# Altium project VM52T2.PrjPcb
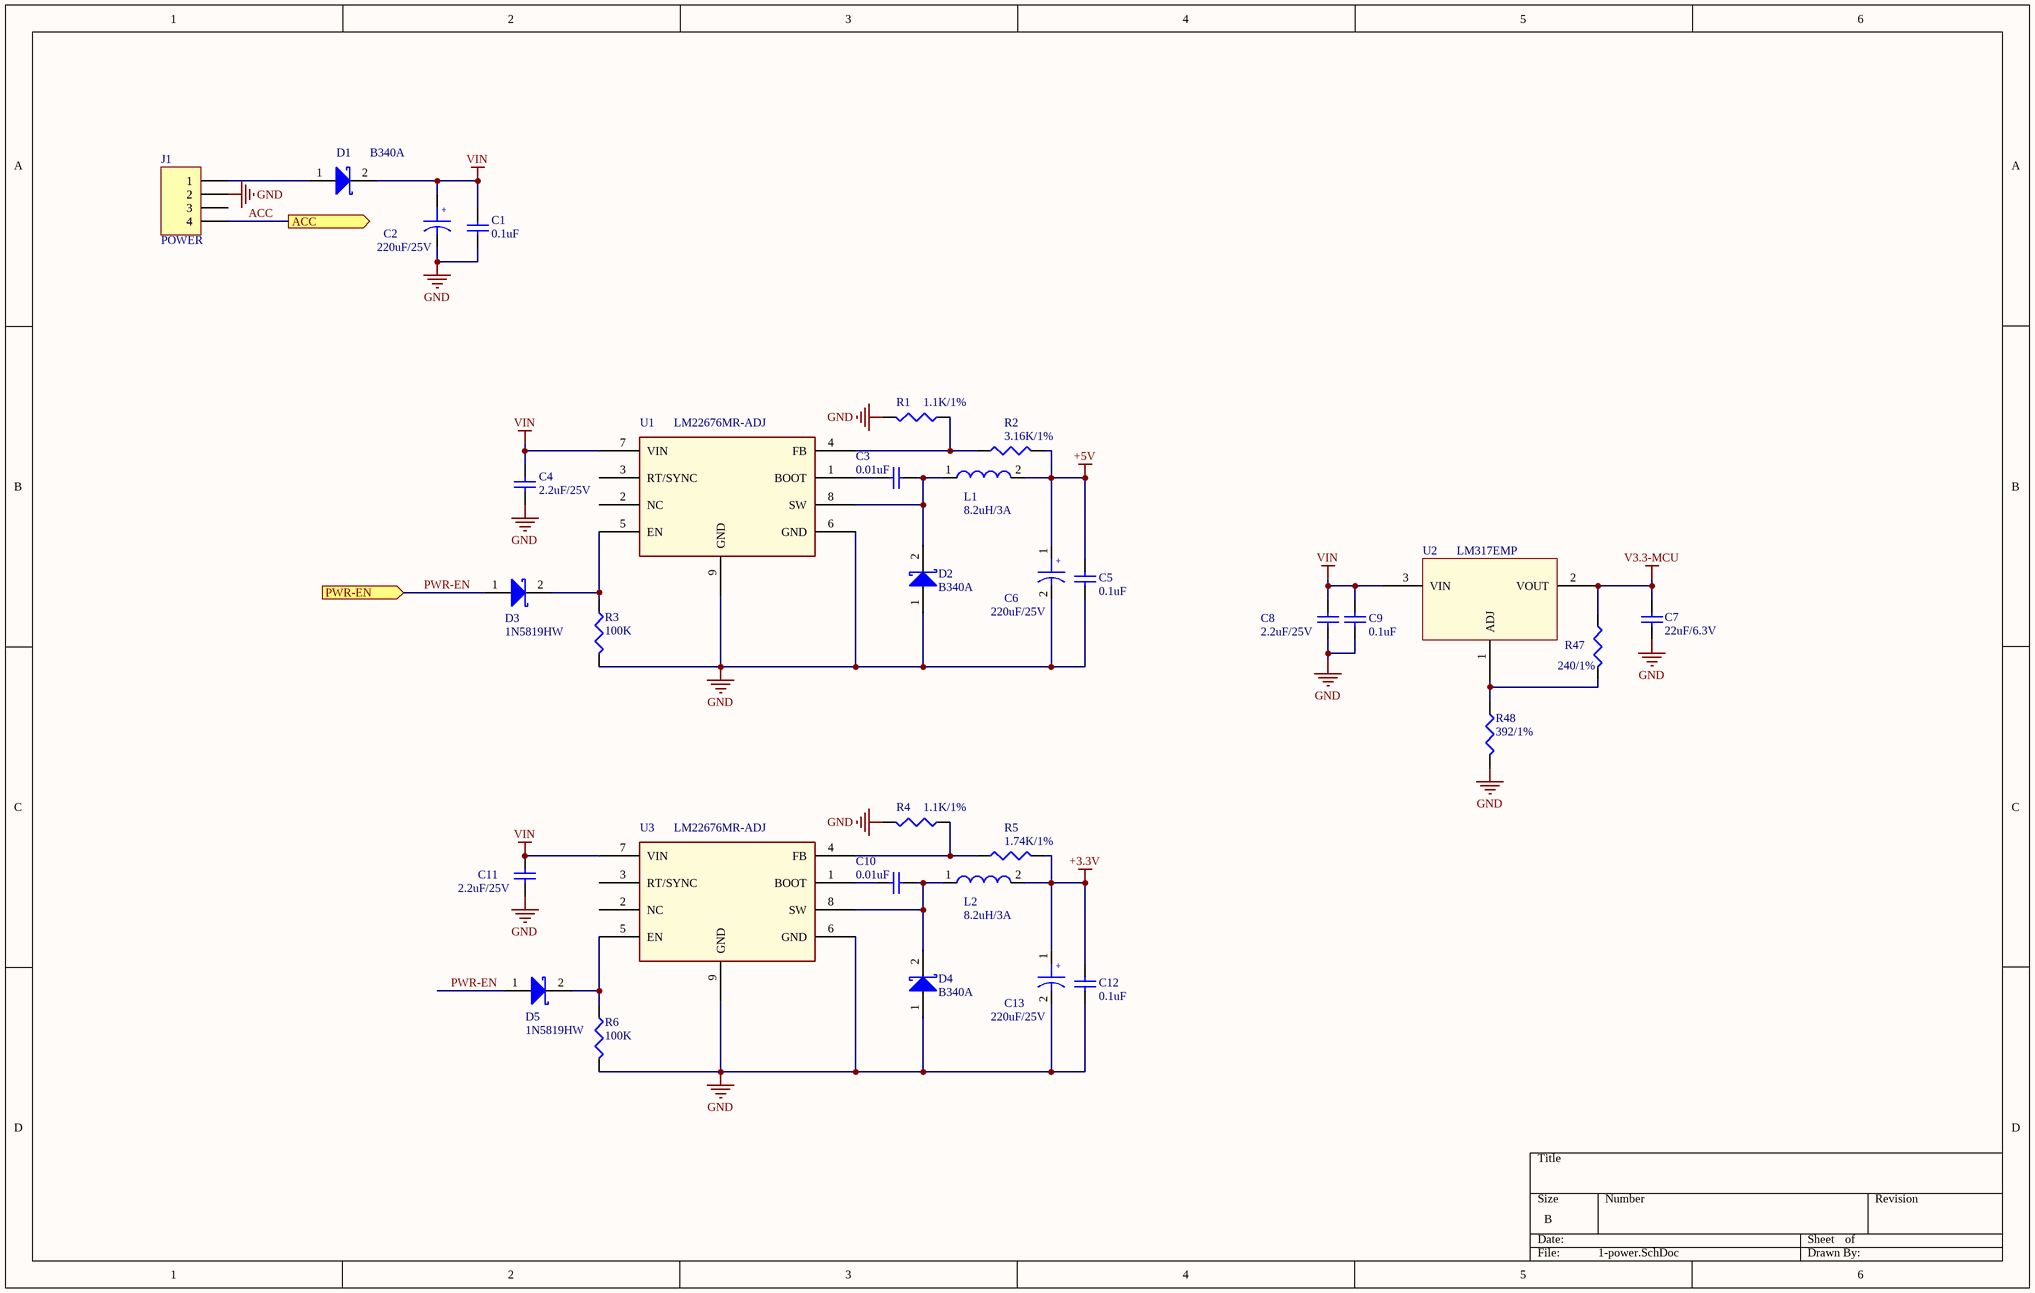
[diagram p0: 1-power.SchDoc]
8 sheets, 188 parts. Net scope: flat (ports and power ports of the same name join across sheets).
Board file: VM52-T2.PcbDoc
Sheets:
  1-power.SchDoc
  2-mcu.SchDoc
  3-core_board.SchDoc
  4-storage.SchDoc
  5-gsm.SchDoc
  6-gsm_ctrl.SchDoc
  7-serial-interfaces.SchDoc
  8-connector.SchDoc

## Sheet 1-power.SchDoc
size B

### Parts
C1  0.1uF  [0603]
C2  220uF/25V  [DL-8*10.5]
C3  0.01uF  [0603]
C4  2.2uF/25V  [1210]
C5  0.1uF  [0603]
C6  220uF/25V  [DL-8*10.5]
C7  22uF/6.3V  [1206]
C8  2.2uF/25V  [1210]
C9  0.1uF  [0603]
C10  0.01uF  [0603]
C11  2.2uF/25V  [1210]
C12  0.1uF  [0603]
C13  220uF/25V  [DL-8*10.5]
D1  B340A  [B320A]
D2  B340A  [B320A]
D3  1N5819HW  [1N5819]
D4  B340A  [B320A]
D5  1N5819HW  [1N5819]
J1  POWER  [3030WV-F-2*2P]
L1  8.2uH/3A  [IND_8.2UH_3A]
L2  8.2uH/3A  [IND_8.2UH_3A]
R1  1.1K/1%  [0603]
R2  3.16K/1%  [0603]
R3  100K  [0603]
R4  1.1K/1%  [0603]
R5  1.74K/1%  [0603]
R6  100K  [0603]
R47  240/1%  [0603]
R48  392/1%  [0603]
U1  LM22676MR-ADJ  [PSO8]
U2  LM317EMP  [SOT-223]
U3  LM22676MR-ADJ  [PSO8]

### Ports
ACC (out), PWR-EN (in)

### Nets
+3.3V: C12.2 C13.1 L2.2 R5.2
+5V: C5.2 C6.1 L1.2 R2.2
GND: C1.1 C2.2 C4.1 C5.1 C6.2 C7.1 C8.1 C9.2 C11.1 C12.1 C13.2 D2.1(A) D4.1(A) J1.2 R1.2 R3.2 R4.2 R6.2 R48.2 U1.6(GND) U1.9(GND) U3.6(GND) U3.9(GND)
V3.3-MCU: C7.2 R47.1 U2.2(VOUT)
VIN: C1.2 C2.1 C4.2 C8.2 C9.1 C11.2 D1.2(K) U1.7(VIN) U2.3(VIN) U3.7(VIN)
ACC: J1.4 ; port ACC
PWR-EN: D3.1(A) D5.1(A) ; port PWR-EN
NetC3_1: C3.1 D2.2(K) L1.1 U1.8(SW)
NetC3_2: C3.2 U1.1(BOOT)
NetC10_1: C10.1 D4.2(K) L2.1 U3.8(SW)
NetC10_2: C10.2 U3.1(BOOT)
NetD1_1: D1.1(A) J1.1
NetD3_2: D3.2(K) R3.1 U1.5(EN)
NetD5_2: D5.2(K) R6.1 U3.5(EN)
NetR1_1: R1.1 R2.1 U1.4(FB)
NetR4_1: R4.1 R5.1 U3.4(FB)
NetR47_2: R47.2 R48.1 U2.1(ADJ)

Not connected (* = marked no-connect by the designer): J1 3; U1 2(NC) 3(RT/SYNC); U3 2(NC) 3(RT/SYNC)

### Notes on the sheet
- (in symbol CAP WP) +

### Library data of the parts
C1 C5 C9 C12 = Cap: Capacitor; Published: 8-Jun-2000; LatestRevisionDate: 17-Jul-2002; LatestRevisionNote: Re-released for DXP Platform.; PackageReference: RAD-0.3; Publisher: Altium Limited; PackageDescription: Radial Cap, Thru-Hole; 2 Leads; 0.3 in Pin Spacing; Value: 0.1uF
C2 C6 C13 = CAP WP
C3 C4 C7 C8 C10 C11 = Cap: Capacitor; Value: 0.1uF; Published: 8-Jun-2000; LatestRevisionDate: 17-Jul-2002; LatestRevisionNote: Re-released for DXP Platform.; PackageReference: RAD-0.3; Publisher: Altium Limited; PackageDescription: Radial Cap, Thru-Hole; 2 Leads; 0.3 in Pin Spacing
D1-D5 = Diode 11DQ03: Schottky Rectifier
J1 = Header 4: Header, 4-Pin; LatestRevisionDate: 17-Jul-2002; LatestRevisionNote: Re-released for DXP Platform.; Publisher: Altium Limited
L1 L2 = 4.7UH_CDH2D09BNP-4R7MC_0.7A_20%: Part Number: SH00000AJ00; ROOM: +1.3V_CORE
R1-R6 R47 R48 = Res3: Resistor; Value: 1K; Published: 8-Jun-2000; LatestRevisionDate: 29-May-2009; LatestRevisionNote: IPC-7351 Footprint Added.; PackageReference: J1-0603; Publisher: Altium Limited; PackageDescription: Chip Resistor
U1 U3 = LM22670_0

## Sheet 2-mcu.SchDoc
size B
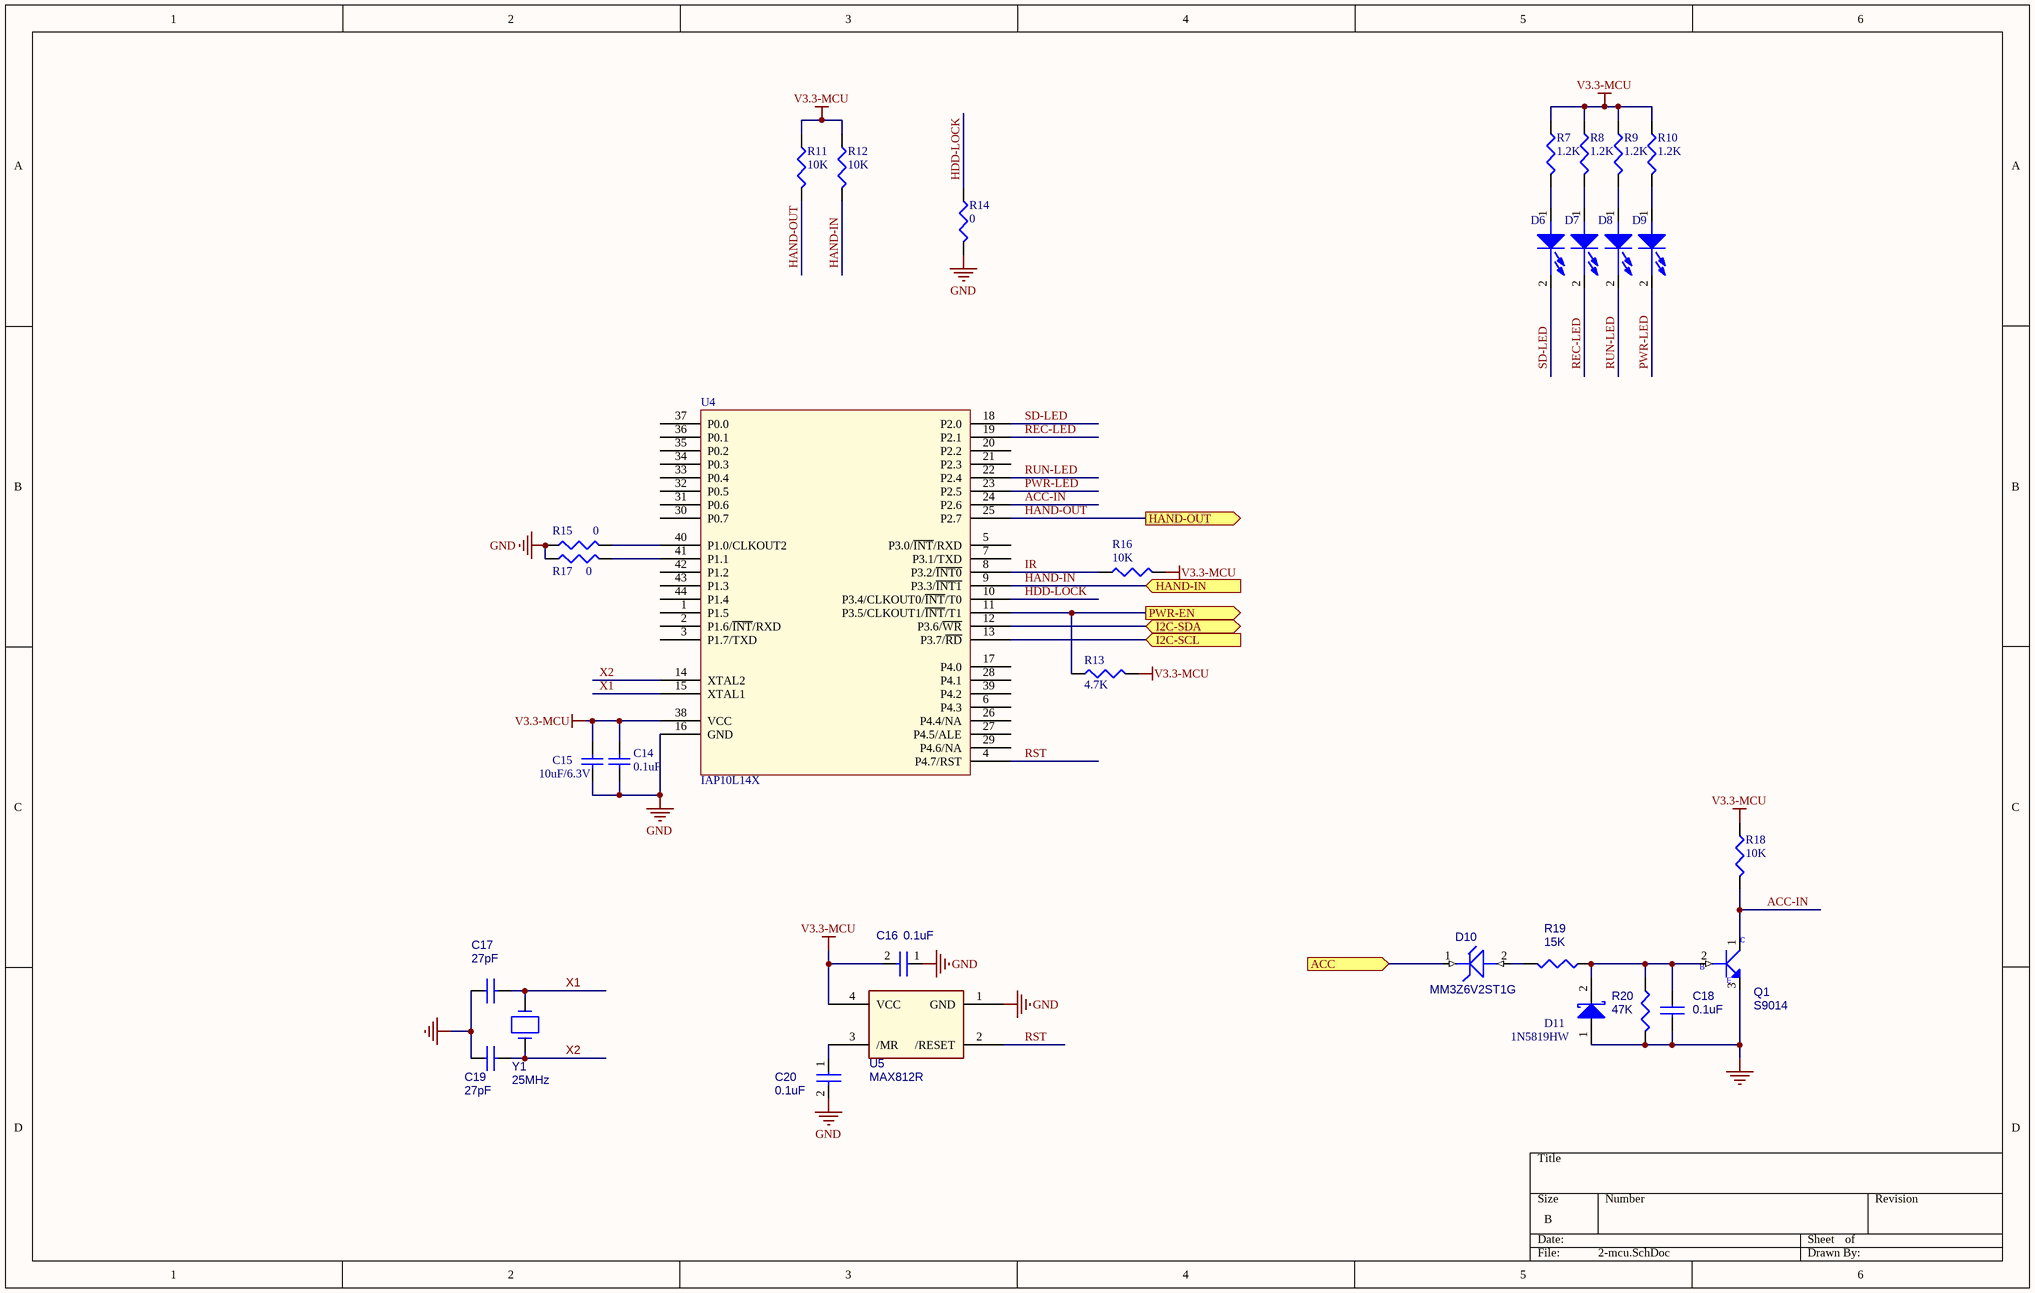
[diagram p1: 2-mcu.SchDoc]

### Parts
C14  0.1uF  [0603]
C15  10uF/6.3V  [0805]
C16  0.1uF  [0603]
C17  27pF  [0603]
C18  0.1uF  [0603]
C19  27pF  [0603]
C20  0.1uF  [0603]
D6  LED GREEN  [LED0603]  (value not drawn)
D7  LED GREEN  [LED0603]  (value not drawn)
D8  LED GREEN  [LED0603]  (value not drawn)
D9  LED GREEN  [LED0603]  (value not drawn)
D10  MM3Z6V2ST1G  [MM3Z5V1ST1G]
D11  1N5819HW  [1N5819]
Q1  S9014  [NPN]
R7  1.2K  [0603]
R8  1.2K  [0603]
R9  1.2K  [0603]
R10  1.2K  [0603]
R11  10K  [0603]
R12  10K  [0603]
R13  4.7K  [0603]
R14  0  [0603]
R15  0  [0603]
R16  10K  [0603]
R17  0  [0603]
R18  10K  [0603]
R19  15K  [0603]
R20  47K  [0603]
U4  IAP10L14X  [LQFP44]
U5  MAX812R  [SOT143]
Y1  25MHz  [SMD-XTAL-5032]

### Ports
ACC (in), HAND-IN (in), HAND-OUT (out), I2C-SCL (in), I2C-SDA (bidir), PWR-EN (out)

### Nets
GND: C14.1 C15.1 C16.1 C17.1 C18.2 C19.1 C20.2 D11.1(A) Q1.3(EMITTER) R14.2 R15.1 R17.1 R20.2 U4.16(GND) U5.1(GND)
V3.3-MCU: C14.2 C15.2 C16.2 R7.1 R8.1 R9.1 R10.1 R11.1 R12.1 R13.2 R16.2 R18.1 U4.38(VCC) U5.4(VCC)
ACC: D10.1 ; port ACC
ACC-IN: Q1.1(COLLECTOR) R18.2 U4.24(P2.6)
HAND-IN: R12.2 U4.9(P3.3/~{INT1}) ; port HAND-IN
HAND-OUT: R11.2 U4.25(P2.7) ; port HAND-OUT
HDD-LOCK: R14.1 U4.10(P3.4/CLKOUT0/~{INT}/T0)
I2C-SCL: U4.13(P3.7/~{RD}) ; port I2C-SCL
I2C-SDA: U4.12(P3.6/~{WR}) ; port I2C-SDA
IR: R16.1 U4.8(P3.2/~{INT0})
PWR-EN: R13.1 U4.11(P3.5/CLKOUT1/~{INT}/T1) ; port PWR-EN
PWR-LED: D9.2(CATHODE) U4.23(P2.5)
REC-LED: D7.2(CATHODE) U4.19(P2.1)
RST: U4.4(P4.7/RST) U5.2(/RESET)
RUN-LED: D8.2(CATHODE) U4.22(P2.4)
SD-LED: D6.2(CATHODE) U4.18(P2.0)
X1: C17.2 U4.15(XTAL1) Y1.2
X2: C19.2 U4.14(XTAL2) Y1.1
NetC18_1: C18.1 D11.2(K) Q1.2(BASE) R19.1 R20.1
NetC20_1: C20.1 U5.3(/MR)
NetD6_1: D6.1(ANODE) R7.2
NetD7_1: D7.1(ANODE) R8.2
NetD8_1: D8.1(ANODE) R9.2
NetD9_1: D9.1(ANODE) R10.2
NetD10_2: D10.2 R19.2
NetR15_2: R15.2 U4.40(P1.0/CLKOUT2)
NetR17_2: R17.2 U4.41(P1.1)

Not connected (* = marked no-connect by the designer): U4 1(P1.5) 2(P1.6/~{INT}/RXD) 3(P1.7/TXD) 5(P3.0/~{INT}/RXD) 6(P4.3) 7(P3.1/TXD) 17(P4.0) 20(P2.2) 21(P2.3) 26(P4.4/NA) 27(P4.5/ALE) 28(P4.1) 29(P4.6/NA) 30(P0.7) 31(P0.6) 32(P0.5) 33(P0.4) 34(P0.3) 35(P0.2) 36(P0.1) 37(P0.0) 39(P4.2) 42(P1.2) 43(P1.3) 44(P1.4)

### Notes on the sheet
- (in symbol MMBT3904_NL_SOT23-3) C; B; E

### Library data of the parts
C14 C15 = Cap: Capacitor
C16 C20 = CAP NP_Dup2
C17 C19 = CAP_Dup1
C18 = CAP
D6-D9 = LN01401_1
D10 = MMGZ5231BPTLL34
D11 = Diode 11DQ03: Schottky Rectifier
Q1 = MMBT3904_NL_SOT23-3: Part Description: S TR MMBT3904_NL NPN SOT23; Part Number: SB039040000
R7-R18 = CR16-1003FM
R19 R20 = R
U5 = MAX811
Y1 = CRYSTAL

## Sheet 3-core_board.SchDoc
size B
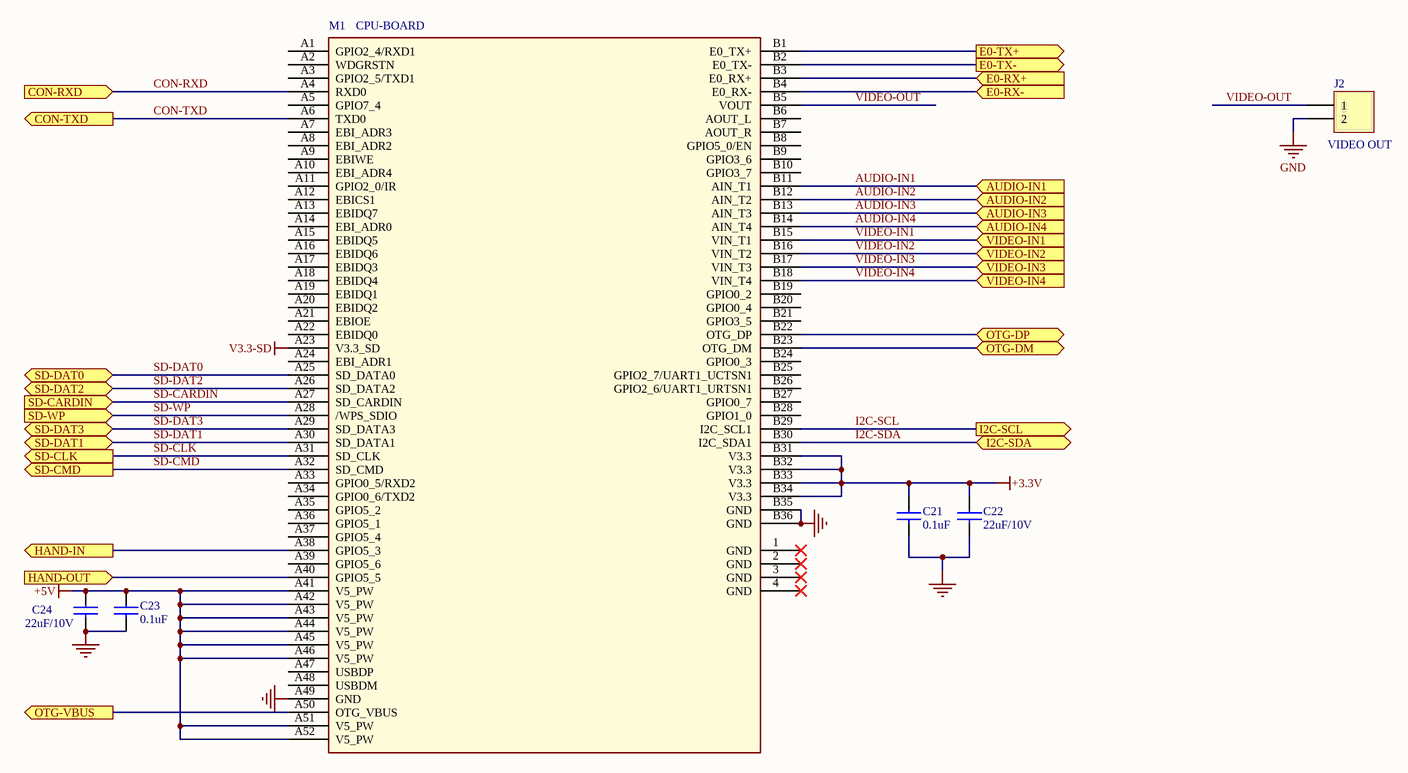
[diagram p2: 3-core_board.SchDoc]

### Parts
C21  0.1uF  [0603]
C22  22uF/10V  [1210]
C23  0.1uF  [0603]
C24  22uF/10V  [1210]
J2  VIDEO OUT  [CON-2PIN]
M1  CPU-BOARD  [cpu-board]

### Ports
AUDIO-IN1 (in), AUDIO-IN2 (in), AUDIO-IN3 (in), AUDIO-IN4 (in), CON-RXD (in), CON-TXD (out), E0-RX+ (in), E0-RX- (in), E0-TX+ (out), E0-TX- (out), HAND-IN (out), HAND-OUT (in), I2C-SCL (out), I2C-SDA (bidir), OTG-DM (bidir), OTG-DP (bidir), OTG-VBUS (out), SD-CARDIN (in), SD-CLK (out), SD-CMD (out), SD-DAT0 (bidir), SD-DAT1 (bidir), SD-DAT2 (bidir), SD-DAT3 (bidir), SD-WP (in), VIDEO-IN1 (in), VIDEO-IN2 (in), VIDEO-IN3 (in), VIDEO-IN4 (in)

### Nets
+3.3V: C21.1 C22.1 M1.B31(V3.3) M1.B32(V3.3) M1.B33(V3.3) M1.B34(V3.3)
+5V: C23.1 C24.1 M1.A41(V5_PW) M1.A42(V5_PW) M1.A43(V5_PW) M1.A44(V5_PW) M1.A45(V5_PW) M1.A46(V5_PW) M1.A51(V5_PW) M1.A52(V5_PW)
GND: C21.2 C22.2 C23.2 C24.2 J2.2 M1.A49(GND) M1.B35(GND) M1.B36(GND)
V3.3-SD: M1.A23(V3.3_SD)
AUDIO-IN1: M1.B11(AIN_T1) ; port AUDIO-IN1
AUDIO-IN2: M1.B12(AIN_T2) ; port AUDIO-IN2
AUDIO-IN3: M1.B13(AIN_T3) ; port AUDIO-IN3
AUDIO-IN4: M1.B14(AIN_T4) ; port AUDIO-IN4
CON-RXD: M1.A4(RXD0) ; port CON-RXD
CON-TXD: M1.A6(TXD0) ; port CON-TXD
ERX_N: M1.B4(E0_RX-) ; port E0-RX-
ERX_P: M1.B3(E0_RX+) ; port E0-RX+
ETX_N: M1.B2(E0_TX-) ; port E0-TX-
ETX_P: M1.B1(E0_TX+) ; port E0-TX+
HAND-IN: M1.A38(GPIO5_3) ; port HAND-IN
HAND-OUT: M1.A40(GPIO5_5) ; port HAND-OUT
I2C-SCL: M1.B29(I2C_SCL1) ; port I2C-SCL
I2C-SDA: M1.B30(I2C_SDA1) ; port I2C-SDA
OTG_N: M1.B23(OTG_DM) ; port OTG-DM
OTG_P: M1.B22(OTG_DP) ; port OTG-DP
SD-CARDIN: M1.A27(SD_CARDIN) ; port SD-CARDIN
SD-CLK: M1.A31(SD_CLK) ; port SD-CLK
SD-CMD: M1.A32(SD_CMD) ; port SD-CMD
SD-DAT0: M1.A25(SD_DATA0) ; port SD-DAT0
SD-DAT1: M1.A30(SD_DATA1) ; port SD-DAT1
SD-DAT2: M1.A26(SD_DATA2) ; port SD-DAT2
SD-DAT3: M1.A29(SD_DATA3) ; port SD-DAT3
SD-WP: M1.A28(/WPS_SDIO) ; port SD-WP
VBUS: M1.A50(OTG_VBUS) ; port OTG-VBUS
VIDEO-IN1: M1.B15(VIN_T1) ; port VIDEO-IN1
VIDEO-IN2: M1.B16(VIN_T2) ; port VIDEO-IN2
VIDEO-IN3: M1.B17(VIN_T3) ; port VIDEO-IN3
VIDEO-IN4: M1.B18(VIN_T4) ; port VIDEO-IN4
VIDEO-OUT: J2.1 M1.B5(VOUT)

Not connected (* = marked no-connect by the designer): M1 1(GND)* 2(GND)* 3(GND)* 4(GND)* A1(GPIO2_4/RXD1) A2(WDGRSTN) A3(GPIO2_5/TXD1) A5(GPIO7_4) A7(EBI_ADR3) A8(EBI_ADR2) A9(EBIWE) A10(EBI_ADR4) A11(GPIO2_0/IR) A12(EBICS1) A13(EBIDQ7) A14(EBI_ADR0) A15(EBIDQ5) A16(EBIDQ6) A17(EBIDQ3) A18(EBIDQ4) A19(EBIDQ1) A20(EBIDQ2) A21(EBIOE) A22(EBIDQ0) A24(EBI_ADR1) A33(GPIO0_5/RXD2) A34(GPIO0_6/TXD2) A35(GPIO5_2) A36(GPIO5_1) A37(GPIO5_4) A39(GPIO5_6) A47(USBDP) A48(USBDM) B6(AOUT_L) B7(AOUT_R) B8(GPIO5_0/EN) B9(GPIO3_6) B10(GPIO3_7) B19(GPIO0_2) B20(GPIO0_4) B21(GPIO3_5) B24(GPIO0_3) B25(GPIO2_7/UART1_UCTSN1) B26(GPIO2_6/UART1_URTSN1) B27(GPIO0_7) B28(GPIO1_0)

### Library data of the parts
C21-C24 = CAP NP_Dup2
J2 = Header 2: Header, 2-Pin; LatestRevisionDate: 17-Jul-2002; LatestRevisionNote: Re-released for DXP Platform.; Publisher: Altium Limited
M1 = CPU-BOARD_4

## Sheet 4-storage.SchDoc
size A4
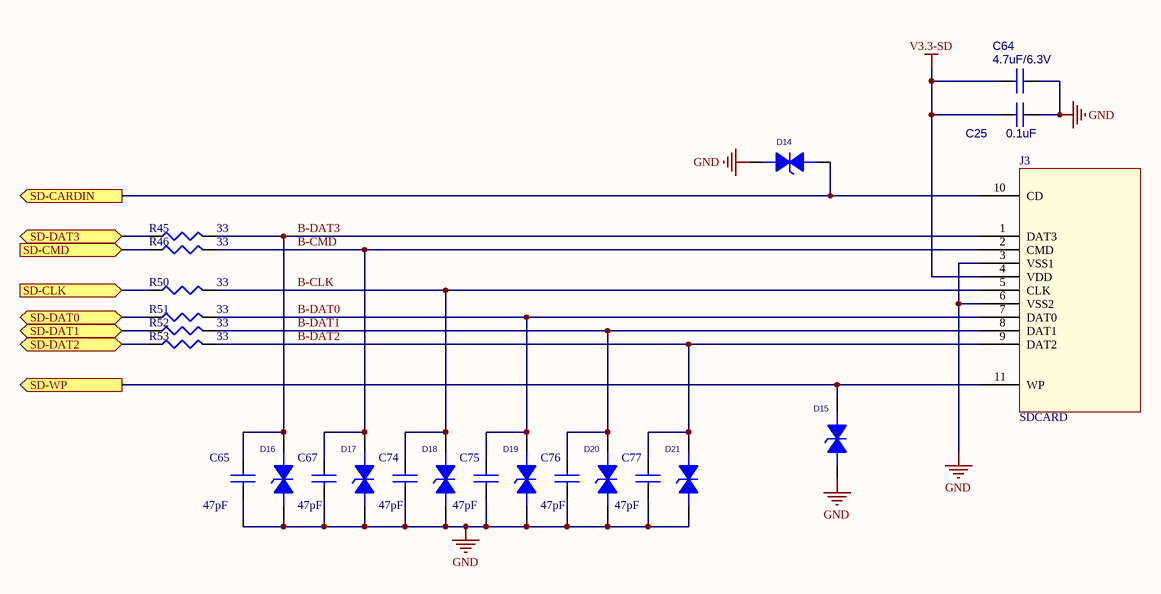
[diagram p3: 4-storage.SchDoc]

### Parts
C25  0.1uF  [0603]
C64  4.7uF/6.3V  [0805]
C65  47pF  [0402]
C67  47pF  [0402]
C74  47pF  [0402]
C75  47pF  [0402]
C76  47pF  [0402]
C77  47pF  [0402]
D14  SMV0402G5R6N121T  [0402]  (value not drawn)
D15  SMV0402G5R6N121T  [0402]  (value not drawn)
D16  SMV0402G5R6N121T  [0402]  (value not drawn)
D17  SMV0402G5R6N121T  [0402]  (value not drawn)
D18  SMV0402G5R6N121T  [0402]  (value not drawn)
D19  SMV0402G5R6N121T  [0402]  (value not drawn)
D20  SMV0402G5R6N121T  [0402]  (value not drawn)
D21  SMV0402G5R6N121T  [0402]  (value not drawn)
J3  SDCARD  [SDCARD]
R45  33  [0603]
R46  33  [0603]
R50  33  [0603]
R51  33  [0603]
R52  33  [0603]
R53  33  [0603]

### Ports
SD-CARDIN (out), SD-CLK (in), SD-CMD (in), SD-DAT0 (bidir), SD-DAT1 (bidir), SD-DAT2 (bidir), SD-DAT3 (bidir), SD-WP (out)

### Nets
GND: C25.1 C64.1 C65.2 C67.2 C74.2 C75.2 C76.2 C77.2 D14.2 D15.1 D16.1 D17.1 D18.1 D19.1 D20.1 D21.1 J3.3(VSS1) J3.6(VSS2)
V3.3-SD: C25.2 C64.2 J3.4(VDD)
B-CLK: C74.1 D18.2 J3.5(CLK) R50.2
B-CMD: C67.1 D17.2 J3.2(CMD) R46.2
B-DAT0: C75.1 D19.2 J3.7(DAT0) R51.2
B-DAT1: C76.1 D20.2 J3.8(DAT1) R52.2
B-DAT2: C77.1 D21.2 J3.9(DAT2) R53.2
B-DAT3: C65.1 D16.2 J3.1(DAT3) R45.2
SD-CARDIN: D14.1 J3.10(CD) ; port SD-CARDIN
SD-CLK: R50.1 ; port SD-CLK
SD-CMD: R46.1 ; port SD-CMD
SD-DAT0: R51.1 ; port SD-DAT0
SD-DAT1: R52.1 ; port SD-DAT1
SD-DAT2: R53.1 ; port SD-DAT2
SD-DAT3: R45.1 ; port SD-DAT3
SD-WP: D15.2 J3.11(WP) ; port SD-WP

### Library data of the parts
C25 C64 C65 C67 C74-C77 = CAP NP_Dup2
D14-D21 = PESD
R45 R46 R50-R53 = CR16-1003FM

## Sheet 5-gsm.SchDoc
size B
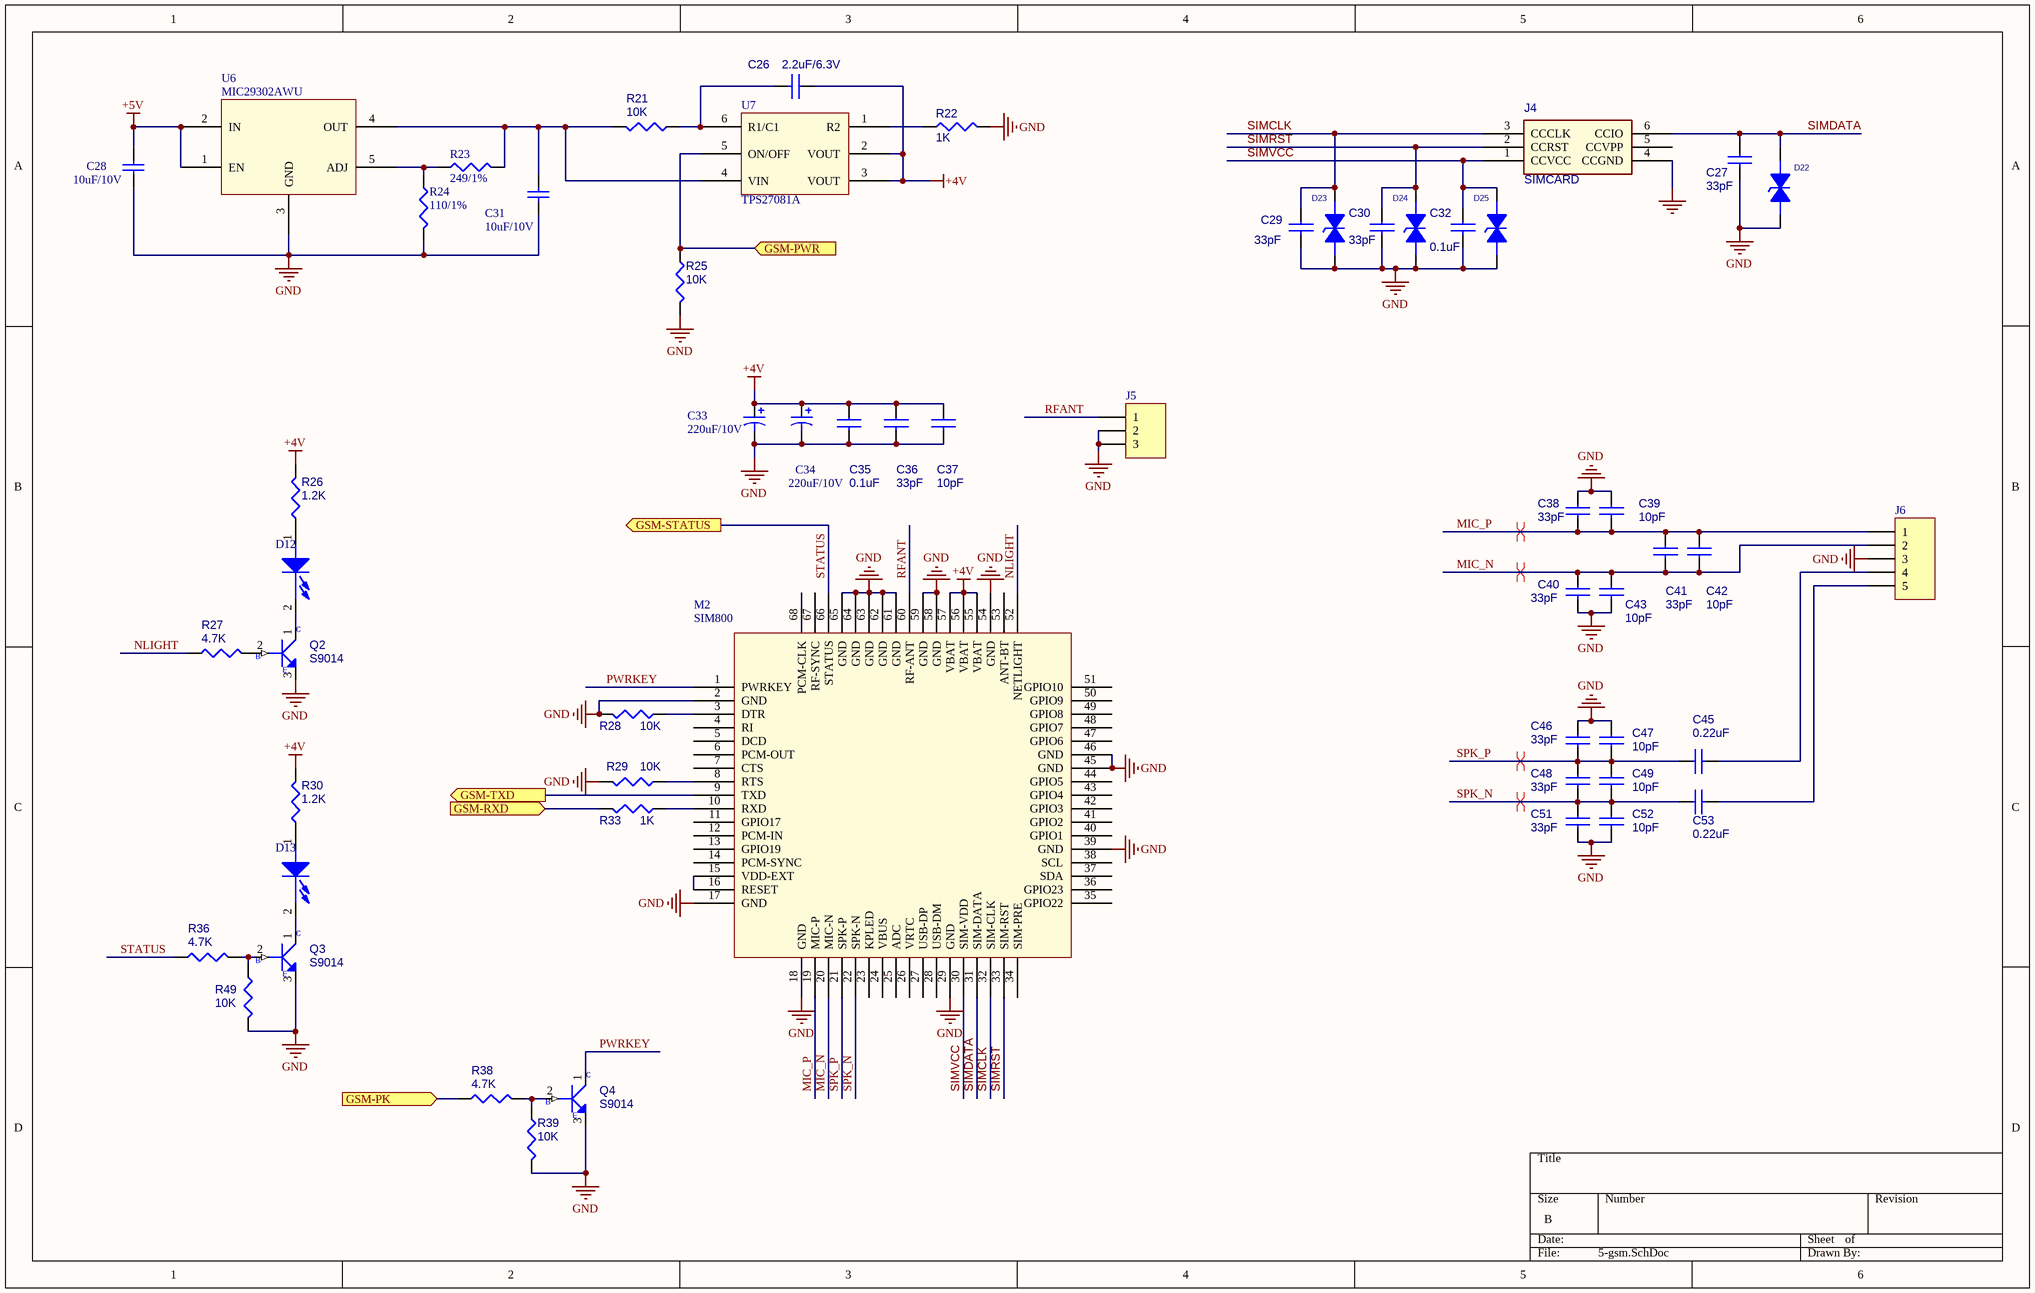
[diagram p4: 5-gsm.SchDoc]

### Parts
C26  2.2uF/6.3V  [0603]
C27  33pF  [0402]
C28  10uF/10V  [1210]
C29  33pF  [0402]
C30  33pF  [0402]
C31  10uF/10V  [1210]
C32  0.1uF  [0402]
C33  220uF/10V  [7343]
C34  220uF/10V  [7343]
C35  0.1uF  [0603]
C36  33pF  [0603]
C37  10pF  [0603]
C38  33pF  [0603]
C39  10pF  [0603]
C40  33pF  [0603]
C41  33pF  [0603]
C42  10pF  [0603]
C43  10pF  [0603]
C45  0.22uF  [0603]
C46  33pF  [0603]
C47  10pF  [0603]
C48  33pF  [0603]
C49  10pF  [0603]
C51  33pF  [0603]
C52  10pF  [0603]
C53  0.22uF  [0603]
D12  LED GREEN  [LED0603]  (value not drawn)
D13  LED GREEN  [LED0603]  (value not drawn)
D22  SMV0402G5R6N121T  [0402]  (value not drawn)
D23  SMV0402G5R6N121T  [0402]  (value not drawn)
D24  SMV0402G5R6N121T  [0402]  (value not drawn)
D25  SMV0402G5R6N121T  [0402]  (value not drawn)
J4  SIMCARD  [SIM_CARD1]
J5  Header 3  [ANT]  (value not drawn)
J6  Header 5  [CON-5PIN]  (value not drawn)
M2  SIM800  [sim800]
Q2  S9014  [NPN]
Q3  S9014  [NPN]
Q4  S9014  [NPN]
R21  10K  [0603]
R22  1K  [0603]
R23  249/1%  [0603]
R24  110/1%  [0603]
R25  10K  [0603]
R26  1.2K  [0603]
R27  4.7K  [0603]
R28  10K  [0603]
R29  10K  [0603]
R30  1.2K  [0603]
R33  1K  [0603]
R36  4.7K  [0603]
R38  4.7K  [0603]
R39  10K  [0603]
R49  10K  [0603]
U6  MIC29302AWU  [TO-263]
U7  TPS27081A  [SOT23-6]

### Ports
GSM-PK (in), GSM-PWR (in), GSM-RXD (in), GSM-STATUS (out), GSM-TXD (out)

### Nets
+4V: C26.1 C33.1 C34.1 C35.1 C36.1 C37.1 M2.55(VBAT) M2.56(VBAT) M2.57(VBAT) R26.1 R30.1 U7.2(VOUT) U7.3(VOUT)
+5V: C28.2 U6.1(EN) U6.2(IN)
GND: C27.2 C28.1 C29.2 C30.2 C31.1 C32.2 C33.2 C34.2 C35.2 C36.2 C37.2 C38.1 C39.1 C40.2 C43.2 C46.1 C47.1 C51.2 C52.2 D22.1 D23.1 D24.1 D25.1 J4.4(CCGND) J5.2 J5.3 J6.3 M2.2(GND) M2.17(GND) M2.18(GND) M2.29(GND) M2.39(GND) M2.45(GND) M2.46(GND) M2.54(GND) M2.58(GND) M2.59(GND) M2.61(GND) M2.62(GND) M2.63(GND) M2.64(GND) M2.65(GND) Q2.3(EMITTER) Q3.3(EMITTER) Q4.3(EMITTER) R22.1 R24.2 R25.1 R28.1 R29.1 R39.1 R49.1 U6.3(GND)
GSM-PK: R38.2 ; port GSM-PK
GSM-PWR: R25.2 U7.5(ON/OFF) ; port GSM-PWR
GSM-RXD: R33.1 ; port GSM-RXD
GSM-TXD: M2.9(TXD) ; port GSM-TXD
MIC_N: C40.1 C41.2 C42.2 C43.1 J6.2 M2.20(MIC-N)
MIC_P: C38.2 C39.2 C41.1 C42.1 J6.1 M2.19(MIC-P)
NLIGHT: M2.52(NETLIGHT) R27.2
PWRKEY: M2.1(PWRKEY) Q4.1(COLLECTOR)
RFANT: J5.1 M2.60(RF-ANT)
SIMCLK: C29.1 D23.2 J4.3(CCCLK) M2.32(SIM-CLK)
SIMDATA: C27.1 D22.2 J4.6(CCIO) M2.31(SIM-DATA)
SIMRST: C30.1 D24.2 J4.2(CCRST) M2.33(SIM-RST)
SIMVCC: C32.1 D25.2 J4.1(CCVCC) M2.30(SIM-VDD)
SPK_N: C48.2 C49.2 C51.1 C52.1 C53.1 M2.22(SPK-N)
SPK_P: C45.1 C46.2 C47.2 C48.1 C49.1 M2.21(SPK-P)
STATUS: M2.66(STATUS) R36.2 ; port GSM-STATUS
NetC26_2: C26.2 R21.2 U7.6(R1/C1)
NetC31_2: C31.2 R21.1 R23.2 U6.4(OUT) U7.4(VIN)
NetC45_2: C45.2 J6.4
NetC53_2: C53.2 J6.5
NetD12_1: D12.1(ANODE) R26.2
NetD12_2: D12.2(CATHODE) Q2.1(COLLECTOR)
NetD13_1: D13.1(ANODE) R30.2
NetD13_2: D13.2(CATHODE) Q3.1(COLLECTOR)
NetM2_3: M2.3(DTR) R28.2
NetM2_8: M2.8(RTS) R29.2
NetM2_10: M2.10(RXD) R33.2
NetM2_15: M2.15(VDD-EXT) M2.16(RESET)
NetQ2_2: Q2.2(BASE) R27.1
NetQ3_2: Q3.2(BASE) R36.1 R49.2
NetQ4_2: Q4.2(BASE) R38.1 R39.2
NetR22_2: R22.2 U7.1(R2)
NetR23_1: R23.1 R24.1 U6.5(ADJ)

Not connected (* = marked no-connect by the designer): J4 5(CCVPP); M2 4(RI) 5(DCD) 6(PCM-OUT) 7(CTS) 11(GPIO17) 12(PCM-IN) 13(GPIO19) 14(PCM-SYNC) 23(KPLED) 24(VBUS) 25(ADC) 26(VRTC) 27(USB-DP) 28(USB-DM) 34(SIM-PRE) 35(GPIO22) 36(GPIO23) 37(SDA) 38(SCL) 40(GPIO1) 41(GPIO2) 42(GPIO3) 43(GPIO4) 44(GPIO5) 47(GPIO6) 48(GPIO7) 49(GPIO8) 50(GPIO9) 51(GPIO10) 53(ANT-BT) 67(RF-SYNC) 68(PCM-CLK)

### Layout directives
differential pair: MIC_N, MIC_P, SPK_N, SPK_P

### Notes on the sheet
- (in symbol MMBT3904_NL_SOT23-3) C; B; E

### Library data of the parts
C26 C27 C29 C30 C32 C35-C43 C45-C49 C51-C53 = P_CAP NP
C28 C31 = Cap: Capacitor; Value: 0.1uF; Published: 8-Jun-2000; LatestRevisionDate: 17-Jul-2002; LatestRevisionNote: Re-released for DXP Platform.; PackageReference: RAD-0.3; Publisher: Altium Limited; PackageDescription: Radial Cap, Thru-Hole; 2 Leads; 0.3 in Pin Spacing
C33 C34 = Cap Pol1: Polarized Capacitor (Radial); Published: 8-Jun-2000; LatestRevisionDate: 17-Jul-2002; LatestRevisionNote: Re-released for DXP Platform.; PackageReference: RB7.6-15; Publisher: Altium Limited; PackageDescription: Polarized Capacitor (Radial); 2 Leads; Value: 220uF/10V
D12 D13 = LN01401_1
D22-D25 = PESD
J5 = Header 3: Header, 3-Pin; LatestRevisionDate: 17-Jul-2002; LatestRevisionNote: Re-released for DXP Platform.; Publisher: Altium Limited
J6 = Header 5: Header, 5-Pin; LatestRevisionDate: 17-Jul-2002; LatestRevisionNote: Re-released for DXP Platform.; Publisher: Altium Limited
Q2-Q4 = MMBT3904_NL_SOT23-3: as Q1 on sheet 2-mcu
R21 R22 R25-R30 R33 R36 R38 R39 R49 = P_R
R23 R24 = Res3: Resistor; Value: 1K; Published: 8-Jun-2000; LatestRevisionDate: 29-May-2009; LatestRevisionNote: IPC-7351 Footprint Added.; PackageReference: J1-0603; Publisher: Altium Limited; PackageDescription: Chip Resistor

## Sheet 6-gsm_ctrl.SchDoc
size B
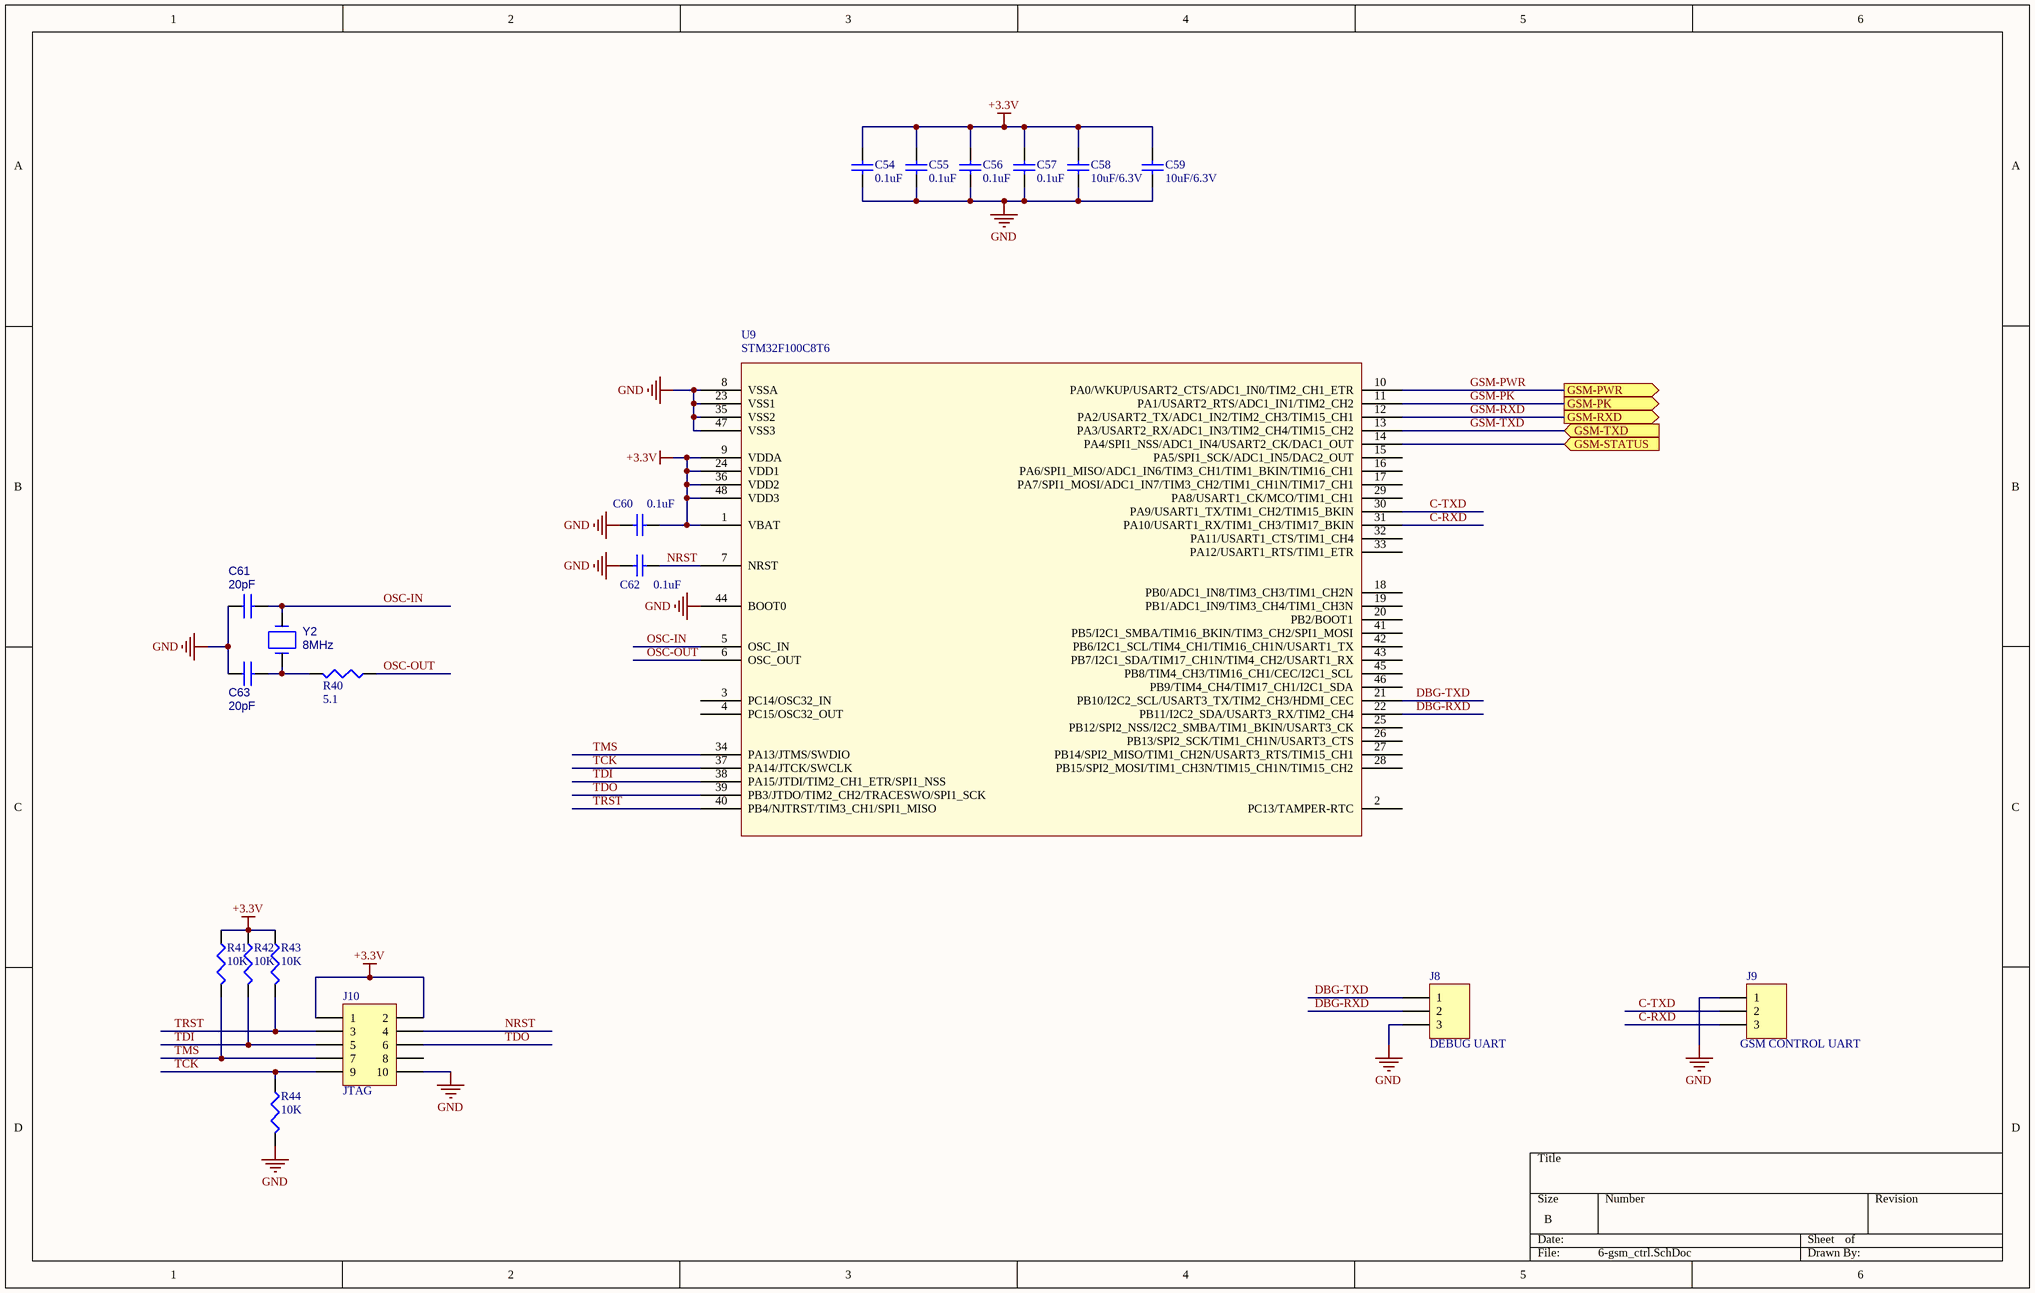
[diagram p5: 6-gsm_ctrl.SchDoc]

### Parts
C54  0.1uF  [0603]
C55  0.1uF  [0603]
C56  0.1uF  [0603]
C57  0.1uF  [0603]
C58  10uF/6.3V  [0805]
C59  10uF/6.3V  [0805]
C60  0.1uF  [0603]
C61  20pF  [0603]
C62  0.1uF  [0603]
C63  20pF  [0603]
J8  DEBUG UART  [HDR1X3]
J9  GSM CONTROL UART  [CONN-3P]
J10  JTAG  [HDR2X5]
R40  5.1  [0603]
R41  10K  [0603]
R42  10K  [0603]
R43  10K  [0603]
R44  10K  [0603]
U9  STM32F100C8T6  [LQFP48]
Y2  8MHz  [SMD-XTAL-5032]

### Ports
GSM-PK (out), GSM-PWR (out), GSM-RXD (out), GSM-STATUS (in), GSM-TXD (in)

### Nets
+3.3V: C54.1 C55.1 C56.1 C57.1 C58.1 C59.1 C60.1 J10.1 J10.2 R41.1 R42.1 R43.1 U9.1(VBAT) U9.9(VDDA) U9.24(VDD1) U9.36(VDD2) U9.48(VDD3)
GND: C54.2 C55.2 C56.2 C57.2 C58.2 C59.2 C60.2 C61.1 C62.1 C63.1 J8.3 J9.1 J10.10 R44.2 U9.8(VSSA) U9.23(VSS1) U9.35(VSS2) U9.44(BOOT0) U9.47(VSS3)
C-RXD: J9.3 U9.31(PA10/USART1_RX/TIM1_CH3/TIM17_BKIN)
C-TXD: J9.2 U9.30(PA9/USART1_TX/TIM1_CH2/TIM15_BKIN)
DBG-RXD: J8.2 U9.22(PB11/I2C2_SDA/USART3_RX/TIM2_CH4)
DBG-TXD: J8.1 U9.21(PB10/I2C2_SCL/USART3_TX/TIM2_CH3/HDMI_CEC)
GSM-PK: U9.11(PA1/USART2_RTS/ADC1_IN1/TIM2_CH2) ; port GSM-PK
GSM-PWR: U9.10(PA0/WKUP/USART2_CTS/ADC1_IN0/TIM2_CH1_ETR) ; port GSM-PWR
GSM-RXD: U9.12(PA2/USART2_TX/ADC1_IN2/TIM2_CH3/TIM15_CH1) ; port GSM-RXD
GSM-TXD: U9.13(PA3/USART2_RX/ADC1_IN3/TIM2_CH4/TIM15_CH2) ; port GSM-TXD
NRST: C62.2 J10.4 U9.7(NRST)
OSC-IN: C61.2 U9.5(OSC_IN) Y2.2
OSC-OUT: R40.1 U9.6(OSC_OUT)
STATUS: U9.14(PA4/SPI1_NSS/ADC1_IN4/USART2_CK/DAC1_OUT) ; port GSM-STATUS
TCK: J10.9 R44.1 U9.37(PA14/JTCK/SWCLK)
TDI: J10.5 R42.2 U9.38(PA15/JTDI/TIM2_CH1_ETR/SPI1_NSS)
TDO: J10.6 U9.39(PB3/JTDO/TIM2_CH2/TRACESWO/SPI1_SCK)
TMS: J10.7 R41.2 U9.34(PA13/JTMS/SWDIO)
TRST: J10.3 R43.2 U9.40(PB4/NJTRST/TIM3_CH1/SPI1_MISO)
NetC63_2: C63.2 R40.2 Y2.1

Not connected (* = marked no-connect by the designer): J10 8; U9 2(PC13/TAMPER-RTC) 3(PC14/OSC32_IN) 4(PC15/OSC32_OUT) 15(PA5/SPI1_SCK/ADC1_IN5/DAC2_OUT) 16(PA6/SPI1_MISO/ADC1_IN6/TIM3_CH1/TIM1_BKIN/TIM16_CH1) 17(PA7/SPI1_MOSI/ADC1_IN7/TIM3_CH2/TIM1_CH1N/TIM17_CH1) 18(PB0/ADC1_IN8/TIM3_CH3/TIM1_CH2N) 19(PB1/ADC1_IN9/TIM3_CH4/TIM1_CH3N) 20(PB2/BOOT1) 25(PB12/SPI2_NSS/I2C2_SMBA/TIM1_BKIN/USART3_CK) 26(PB13/SPI2_SCK/TIM1_CH1N/USART3_CTS) 27(PB14/SPI2_MISO/TIM1_CH2N/USART3_RTS/TIM15_CH1) 28(PB15/SPI2_MOSI/TIM1_CH3N/TIM15_CH1N/TIM15_CH2) 29(PA8/USART1_CK/MCO/TIM1_CH1) 32(PA11/USART1_CTS/TIM1_CH4) 33(PA12/USART1_RTS/TIM1_ETR) 41(PB5/I2C1_SMBA/TIM16_BKIN/TIM3_CH2/SPI1_MOSI) 42(PB6/I2C1_SCL/TIM4_CH1/TIM16_CH1N/USART1_TX) 43(PB7/I2C1_SDA/TIM17_CH1N/TIM4_CH2/USART1_RX) 45(PB8/TIM4_CH3/TIM16_CH1/CEC/I2C1_SCL) 46(PB9/TIM4_CH4/TIM17_CH1/I2C1_SDA)

### Library data of the parts
C54-C57 C60 C62 = Cap: Capacitor; Published: 8-Jun-2000; LatestRevisionDate: 17-Jul-2002; LatestRevisionNote: Re-released for DXP Platform.; PackageReference: RAD-0.3; Publisher: Altium Limited; PackageDescription: Radial Cap, Thru-Hole; 2 Leads; 0.3 in Pin Spacing; Value: 0.1uF
C58 C59 = Cap: Capacitor; Value: 0.1uF; Published: 8-Jun-2000; LatestRevisionDate: 17-Jul-2002; LatestRevisionNote: Re-released for DXP Platform.; PackageReference: RAD-0.3; Publisher: Altium Limited; PackageDescription: Radial Cap, Thru-Hole; 2 Leads; 0.3 in Pin Spacing
C61 C63 = CAP_Dup1
J8 J9 = Header 3: Header, 3-Pin; LatestRevisionDate: 17-Jul-2002; LatestRevisionNote: Re-released for DXP Platform.; Publisher: Altium Limited
J10 = Header 5X2: Header, 5-Pin, Dual row; LatestRevisionDate: 17-Jul-2002; LatestRevisionNote: Re-released for DXP Platform.; Publisher: Altium Limited
R40-R44 = Res3: Resistor; Value: 0.1/1W; Published: 8-Jun-2000; LatestRevisionDate: 29-May-2009; LatestRevisionNote: IPC-7351 Footprint Added.; PackageReference: J1-0603; Publisher: Altium Limited; PackageDescription: Chip Resistor
U9 = STM32F100XX-LQFP48
Y2 = CRYSTAL

## Sheet 7-serial-interfaces.SchDoc
size B
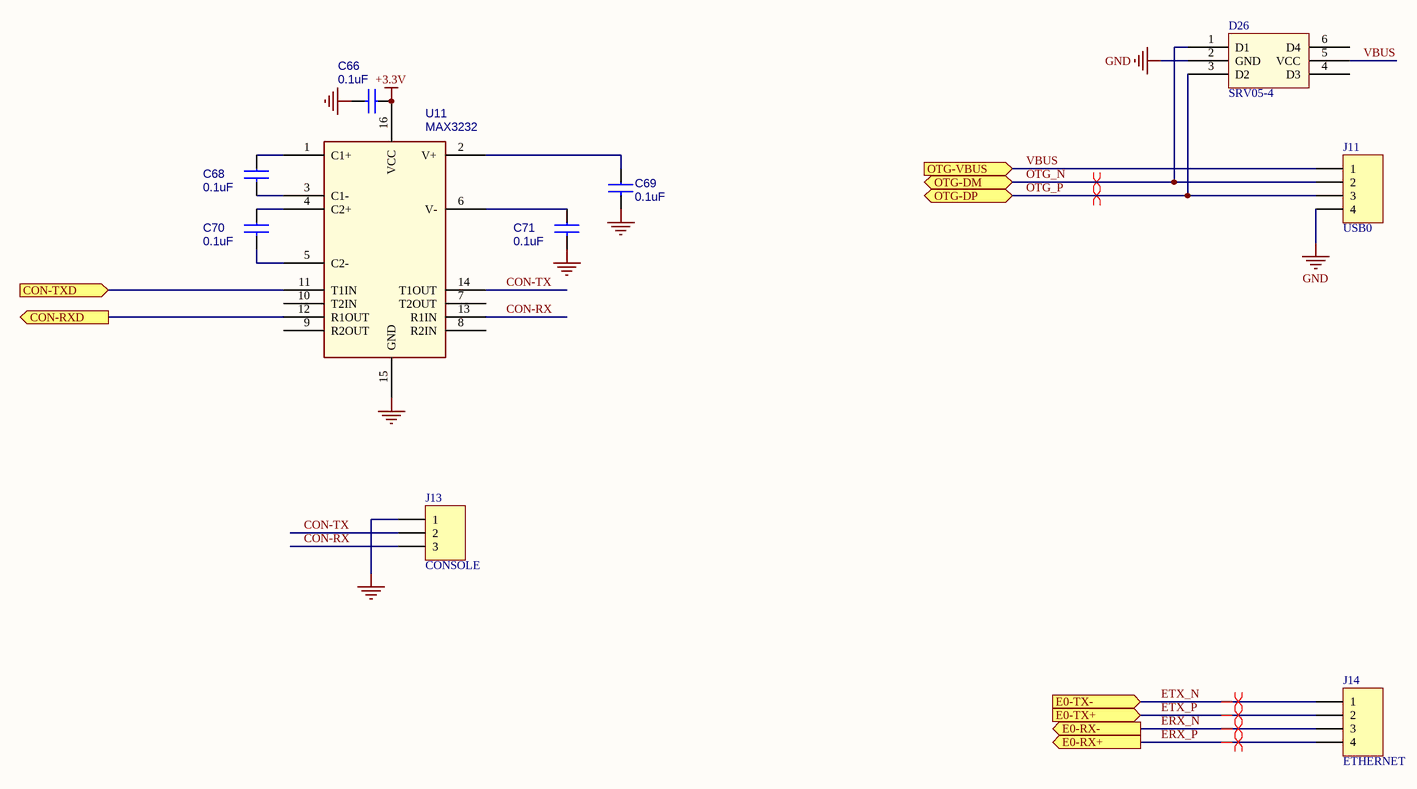
[diagram p6: 7-serial-interfaces.SchDoc]

### Parts
C66  0.1uF  [0603]
C68  0.1uF  [0603]
C69  0.1uF  [0603]
C70  0.1uF  [0603]
C71  0.1uF  [0603]
D26  SRV05-4  [SOT23-6]
J11  USB0  [CON-4PIN]
J13  CONSOLE  [CONN-3P]
J14  ETHERNET  [CON-4PIN]
U11  MAX3232  [SO-16]

### Ports
CON-RXD (out), CON-TXD (in), E0-RX+ (out), E0-RX- (out), E0-TX+ (in), E0-TX- (in), OTG-DM (bidir), OTG-DP (bidir), OTG-VBUS (in)

### Nets
+3.3V: C66.1 U11.16(VCC)
GND: C66.2 C69.2 C71.2 D26.2(GND) J11.4 J13.1 U11.15(GND)
CON-RX: J13.3 U11.13(R1IN)
CON-RXD: U11.12(R1OUT) ; port CON-RXD
CON-TX: J13.2 U11.14(T1OUT)
CON-TXD: U11.11(T1IN) ; port CON-TXD
ERX_N: J14.3 ; port E0-RX-
ERX_P: J14.4 ; port E0-RX+
ETX_N: J14.1 ; port E0-TX-
ETX_P: J14.2 ; port E0-TX+
OTG_N: D26.1(D1) J11.2 ; port OTG-DM
OTG_P: D26.3(D2) J11.3 ; port OTG-DP
VBUS: D26.5(VCC) J11.1 ; port OTG-VBUS
NetC68_1: C68.1 U11.1(C1+)
NetC68_2: C68.2 U11.3(C1-)
NetC69_1: C69.1 U11.2(V+)
NetC70_1: C70.1 U11.4(C2+)
NetC70_2: C70.2 U11.5(C2-)
NetC71_1: C71.1 U11.6(V-)

Not connected (* = marked no-connect by the designer): D26 4(D3) 6(D4); U11 7(T2OUT) 8(R2IN) 9(R2OUT) 10(T2IN)

### Layout directives
differential pair: ERX_N, ERX_P, ETX_N, ETX_P, OTG_N, OTG_P

### Library data of the parts
C66 C68-C71 = CAP
J11 J14 = Header 4: Header, 4-Pin; LatestRevisionDate: 17-Jul-2002; LatestRevisionNote: Re-released for DXP Platform.; Publisher: Altium Limited
J13 = Header 3: Header, 3-Pin; LatestRevisionDate: 17-Jul-2002; LatestRevisionNote: Re-released for DXP Platform.; Publisher: Altium Limited

## Sheet 8-connector.SchDoc
size A4
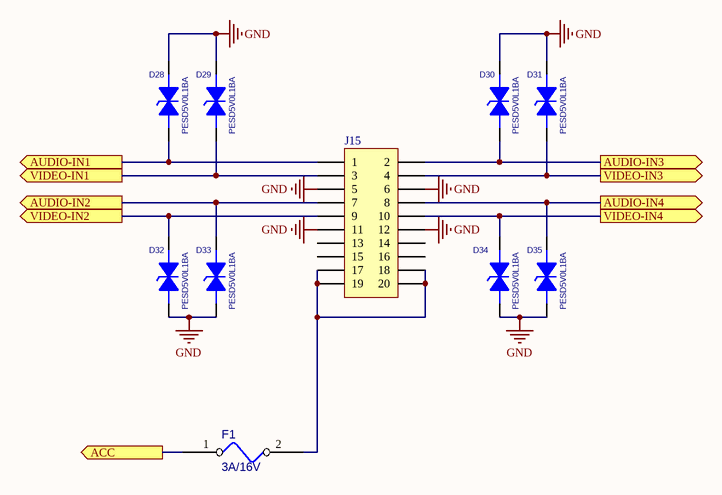
[diagram p7: 8-connector.SchDoc]

### Parts
D28  PESD5V0L1BA  [SOD323]
D29  PESD5V0L1BA  [SOD323]
D30  PESD5V0L1BA  [SOD323]
D31  PESD5V0L1BA  [SOD323]
D32  PESD5V0L1BA  [SOD323]
D33  PESD5V0L1BA  [SOD323]
D34  PESD5V0L1BA  [SOD323]
D35  PESD5V0L1BA  [SOD323]
F1  3A/16V  [2920]
J15  Header 10X2  [CONN2X10]  (value not drawn)

### Ports
ACC (out), AUDIO-IN1 (out), AUDIO-IN2 (out), AUDIO-IN3 (out), AUDIO-IN4 (out), VIDEO-IN1 (out), VIDEO-IN2 (out), VIDEO-IN3 (out), VIDEO-IN4 (out)

### Nets
GND: D28.2 D29.2 D30.2 D31.2 D32.1 D33.1 D34.1 D35.1 J15.5 J15.6 J15.11 J15.12
ACC: F1.1 ; port ACC
AUDIO-IN1: D28.1 J15.1 ; port AUDIO-IN1
AUDIO-IN2: D33.2 J15.7 ; port AUDIO-IN2
AUDIO-IN3: D30.1 J15.2 ; port AUDIO-IN3
AUDIO-IN4: D35.2 J15.8 ; port AUDIO-IN4
VIDEO-IN1: D29.1 J15.3 ; port VIDEO-IN1
VIDEO-IN2: D32.2 J15.9 ; port VIDEO-IN2
VIDEO-IN3: D31.1 J15.4 ; port VIDEO-IN3
VIDEO-IN4: D34.2 J15.10 ; port VIDEO-IN4
NetF1_2: F1.2 J15.17 J15.18 J15.19 J15.20

Not connected (* = marked no-connect by the designer): J15 13 14 15 16

### Library data of the parts
D28-D35 = PESD
F1 = 2A_32VDC_0467-002
J15 = Header 10X2: Header, 10-Pin, Dual row; LatestRevisionDate: 17-Jul-2002; LatestRevisionNote: Re-released for DXP Platform.; Publisher: Altium Limited

## Nets that join several sheets
+3.3V: 1-power (C12.2 C13.1 L2.2 R5.2), 3-core_board (6 pins), 6-gsm_ctrl (17 pins), 7-serial-interfaces (C66.1 U11.16)
+5V: 1-power (C5.2 C6.1 L1.2 R2.2), 3-core_board (10 pins), 5-gsm (C28.2 U6.1 U6.2)
GND: 1-power (23 pins), 2-mcu (15 pins), 3-core_board (8 pins), 4-storage (18 pins), 5-gsm (53 pins), 6-gsm_ctrl (19 pins), 7-serial-interfaces (7 pins), 8-connector (12 pins)
V3.3-MCU: 1-power (C7.2 R47.1 U2.2), 2-mcu (14 pins)
V3.3-SD: 3-core_board (M1.A23), 4-storage (C25.2 C64.2 J3.4)
ACC: 1-power (J1.4), 2-mcu (D10.1), 8-connector (F1.1)
AUDIO-IN1: 3-core_board (M1.B11), 8-connector (D28.1 J15.1)
AUDIO-IN2: 3-core_board (M1.B12), 8-connector (D33.2 J15.7)
AUDIO-IN3: 3-core_board (M1.B13), 8-connector (D30.1 J15.2)
AUDIO-IN4: 3-core_board (M1.B14), 8-connector (D35.2 J15.8)
CON-RXD: 3-core_board (M1.A4), 7-serial-interfaces (U11.12)
CON-TXD: 3-core_board (M1.A6), 7-serial-interfaces (U11.11)
ERX_N: 3-core_board (M1.B4), 7-serial-interfaces (J14.3)
ERX_P: 3-core_board (M1.B3), 7-serial-interfaces (J14.4)
ETX_N: 3-core_board (M1.B2), 7-serial-interfaces (J14.1)
ETX_P: 3-core_board (M1.B1), 7-serial-interfaces (J14.2)
GSM-PK: 5-gsm (R38.2), 6-gsm_ctrl (U9.11)
GSM-PWR: 5-gsm (R25.2 U7.5), 6-gsm_ctrl (U9.10)
GSM-RXD: 5-gsm (R33.1), 6-gsm_ctrl (U9.12)
GSM-TXD: 5-gsm (M2.9), 6-gsm_ctrl (U9.13)
HAND-IN: 2-mcu (R12.2 U4.9), 3-core_board (M1.A38)
HAND-OUT: 2-mcu (R11.2 U4.25), 3-core_board (M1.A40)
I2C-SCL: 2-mcu (U4.13), 3-core_board (M1.B29)
I2C-SDA: 2-mcu (U4.12), 3-core_board (M1.B30)
OTG_N: 3-core_board (M1.B23), 7-serial-interfaces (D26.1 J11.2)
OTG_P: 3-core_board (M1.B22), 7-serial-interfaces (D26.3 J11.3)
PWR-EN: 1-power (D3.1 D5.1), 2-mcu (R13.1 U4.11)
SD-CARDIN: 3-core_board (M1.A27), 4-storage (D14.1 J3.10)
SD-CLK: 3-core_board (M1.A31), 4-storage (R50.1)
SD-CMD: 3-core_board (M1.A32), 4-storage (R46.1)
SD-DAT0: 3-core_board (M1.A25), 4-storage (R51.1)
SD-DAT1: 3-core_board (M1.A30), 4-storage (R52.1)
SD-DAT2: 3-core_board (M1.A26), 4-storage (R53.1)
SD-DAT3: 3-core_board (M1.A29), 4-storage (R45.1)
SD-WP: 3-core_board (M1.A28), 4-storage (D15.2 J3.11)
STATUS: 5-gsm (M2.66 R36.2), 6-gsm_ctrl (U9.14)
VBUS: 3-core_board (M1.A50), 7-serial-interfaces (D26.5 J11.1)
VIDEO-IN1: 3-core_board (M1.B15), 8-connector (D29.1 J15.3)
VIDEO-IN2: 3-core_board (M1.B16), 8-connector (D32.2 J15.9)
VIDEO-IN3: 3-core_board (M1.B17), 8-connector (D31.1 J15.4)
VIDEO-IN4: 3-core_board (M1.B18), 8-connector (D34.2 J15.10)